# Altium schematic sheet Power.SchDoc
size A; DocumentNumber: 1; SheetNumber: 1; SheetTotal: 3
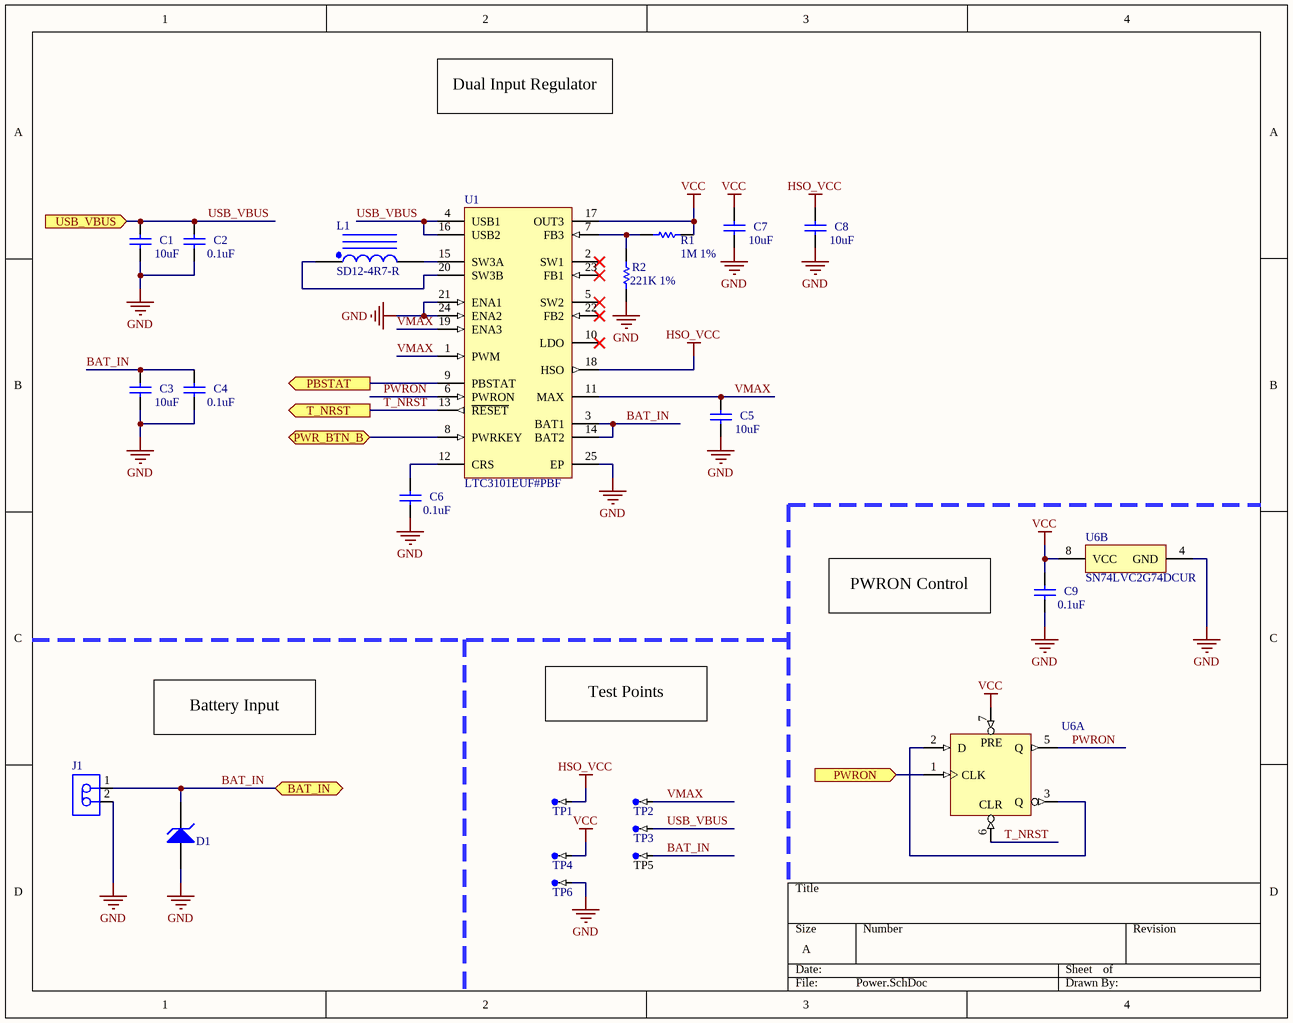
[diagram p0: Power.SchDoc]

## Parts
(Parts that share a designator on the sheet are numbered #1, #2 ... from top to bottom, then left to right.)
C1  10uF  [CAPC0603(1608)100_L]
C2  0.1uF  [CAPC0603(1608)100_L]
C3  10uF  [CAPC0603(1608)100_L]
C4  0.1uF  [CAPC0603(1608)100_L]
C5  10uF  [CAPC0603(1608)100_L]
C6  0.1uF  [CAPC0603(1608)100_L]
C7  10uF  [CAPC0603(1608)100_L]
C8  10uF  [CAPC0603(1608)100_L]
C9  0.1uF  [CAPC0603(1608)100_L]
D1  XGD10603MR  [TECO-0603_V]  (value not drawn)
J1  640456-2  [TECO-640456-2_V]  (value not drawn)
L1  SD12-4R7-R  [EATN-SD12_V]
R1  1M 1%  [RESC0603(1608)_N]
R2  221K 1%  [RESC0603(1608)_N]
TP1  TP-SM-C-100  [TP-SM-C-100]  (value not drawn)  (no BOM)
TP2  TP-SM-C-100  [TP-SM-C-100]  (value not drawn)  (no BOM)
TP3  TP-SM-C-100  [TP-SM-C-100]  (value not drawn)  (no BOM)
TP4  TP-SM-C-100  [TP-SM-C-100]  (value not drawn)  (no BOM)
TP5  TP-SM-C-100  [TP-SM-C-100]  (value not drawn)  (no BOM)
TP6  TP-SM-C-100  [TP-SM-C-100]  (value not drawn)  (no BOM)
U1  LTC3101EUF#PBF  [LT-UF-24_N]
U6#1  SN74LVC2G74DCUR  [DCU0008A_N]  (part B of 2)
U6#2  SN74LVC2G74DCUR  [DCU0008A_N]  (value not drawn)  (part A of 2)

## Ports
BAT_IN (bidir), PBSTAT (out), PWR_BTN_B (bidir), PWRON (in), T_NRST (out), USB_VBUS (in)

## Nets
GND: C1.1 C2.2 C3.1 C4.2 C5.1 C6.2 C7.1 C8.1 C9.2 D1.1(A) J1.2 R2.1 TP6.1 U1.21(ENA1) U1.24(ENA2) U1.25(EP) U6#1.4(GND)
HSO_VCC: C8.2 TP1.1 U1.18(HSO)
VCC: C7.2 C9.1 R1.1 TP4.1 U1.17(OUT3) U6#1.8(VCC) U6#2.7(~{PRE})
BAT_IN: C3.2 C4.1 D1.2(K) J1.1 TP5.1 U1.3(BAT1) U1.14(BAT2) ; port BAT_IN
PBSTAT: U1.9(PBSTAT) ; port PBSTAT
PWR_BTN_B: U1.8(PWRKEY) ; port PWR_BTN_B
PWRON: U1.6(PWRON) U6#2.5(Q)
PWRON: U6#2.1(CLK) ; port PWRON  [a separate net that carries the same name]
T_NRST: U1.13(~{RESET}) U6#2.6(~{CLR}) ; port T_NRST
USB_VBUS: C1.2 C2.1 TP3.1 U1.4(USB1) U1.16(USB2) ; port USB_VBUS
VMAX: C5.2 TP2.1 U1.1(PWM) U1.11(MAX) U1.19(ENA3)
NetC6_1: C6.1 U1.12(CRS)
NetL1_1: L1.1 U1.20(SW3B)
NetL1_2: L1.2 U1.15(SW3A)
NetR1_2: R1.2 R2.2 U1.7(FB3)
NetU6#2_2: U6#2.2(D) U6#2.3(Q)

Not connected (* = marked no-connect by the designer): U1 2(SW1)* 5(SW2)* 10(LDO)* 22(FB2)* 23(FB1)*

## Notes on the sheet
- Dual Input Regulator
- PWRON Control
- Battery Input
- Test Points
- (in symbol CMP-0859-00648-3, part A) PRE; CLR

## Library data of the parts
C1-C9 = CMP-1035-00873-1: CAP 27pF 16V ±0.5pF 0603 (1608 Metric) Thickness 1mm SMD; Tolerance: Â±0.5pF; Case-Metric: 1608; Case-EIA: 0603; Value: 27pF; Max Thickness: 1 mm; Rated Voltage: 16 V; Technology: SMT
D1 = CMP-2000-06889-1: ESD Protector Overvoltage Protection Device, 0.25 pF, 24 V, -55 to 125 degC, 2-Pin SMD (0603), RoHS, Tape and Reel; Manufacturer: TE Connectivity; Capacitance Value: 0.25pF; Rad Hardened: No; Leakage Current (Max): 10uA; Clamping Voltage: 45(Typ)V; Product Height (mm): 0.55mm; Working Voltage: 24V; Product Length (mm): 1.7(Max)mm; Direction Type: Bi-Directional; Number of  Elements: 1; Product Depth (mm): 1(Max)mm; Datasheet Version: Rev. G, 11/2012; Package Reference: 0603; Operating Temperature Max Deg. C: 125C; Packaging: TapeandReel/Box; Leakage Current: 10uA; Datasheet URL: https://datasheet.ciiva.com/30563/eng-ss-scd27256-c-30563476.pdf; Mounting: SurfaceMount; Manufacturer URL: http://www.te.com/; Operating Temperature Classification: Military; Reverse Stand-off Voltage: 24V; Working Voltage (Max): 24V; Mounting Style: SurfaceMount; Operating Temperature Min Deg. C: -55C; Operating Temp Range: -55Cto125C; Pin Count: 2; Mounting Technology: SurfaceMount; Package Description: 2-Pin Surface Mount Device, Body 1.60 x 0.825 mm
J1 = CMP-2000-05417-1: Male Header, Pitch 2.54 mm, 1 x 2 Position, Height 10.49 mm, Tail Length 3.556 mm, -55 to 105 degC, RoHS, Bulk; Manufacturer: TE Connectivity; Standards: RoHSCompliant,ELVCompliant,UL94V-0; Material, Housing: Polyester; Agency Approvals: CSA,UL; Brand/Series: MTA-100Series; Contact Centerline Spacing: 0.100 / in.; Material, Contact: CopperAlloy; Current, Rating: 5 / A; Color, Housing: White; Contact Termination Area Plating: Tin; Special Features: Pinstrip; Number of Positions: 2; Pin Spacing: 0.1 / "; Temperature, Operating: -55to+105 / degC; Angle: Straight; Mount Angle: Vertical; Connector Type: MTA-100; Primary Type: InterconnectSystem; Voltage, Rating: 250 / V; Mounting Hole Size: 0.04 / "; Number of Rows: 1; Termination: Solder; Length, Terminal Post: 0.14 / in.; Manufacturer URL: http://www.te.com/; Color: White; Size, Post: 0.025 / in.; Contact Shape: Square; Mounting Type: PCMount; Datasheet URL: https://datasheet.ciiva.com/11746/0900766b80eb7fdd-11746365.pdf; Type: PCBPlug; Datasheet Version: Rev. W, 06/2004; Number of Contacts: 2; Flammability Rating: UL94V-0; Contact Plating: Tin; Length, Pin: 0.14 / "; Contact Mating Area Plating: Tin; Length, Overall: 0.2 / "
L1 = CMP-2000-07038-1: SD Series High Power Density, Low Profile, Shielded Inductor, 4.7 uH, -40 to 85 degC, 2-Pin SMD, RoHS, Tape and Reel; Manufacturer: Eaton; Maximum DC Resistance: 117.7mOhms; Unit Weight: 0.032000oz; Test Frequency: 100kHz; Inductance: 4.7uH; Maximum DC Current: 1.29A; Brand: Coiltronics/Eaton; Tolerance: 20%; Core Material: Ferrite; Type: LowProfilePowerInductor; Height: 1.2mm; Width: 5.2mm; Product Category: FixedInductors; Shielding: Shielded; Operating Temperature Range: -40Cto+85C; Series: SD; Datasheet Version: 03/2007; Datasheet URL: http://datasheet.octopart.com/SD12-4R7-R-Coiltronics-datasheet-5402826.pdf; Package Description: 2-Pin Surface Mount Device, Body 5.2 x 5.2 mm; RoHS: True; Mounting Technology: SurfaceMount; Packaging: Reel; Package Reference: SD12; Length: 5.2mm; Product: PowerInductors; Factory Pack Quantity: 3800; Termination Style: SMD/SMT; Manufacturer URL: http://www.eaton.com/
R1 R2 = CMP-1012-00001-1: Jumper 0603 (1608 Metric); Case-Metric: 1608; Value: 0.00 Ohm; Power: None; Case-EIA: 0603; Technology: SMT; Tolerance: None
TP1-TP6 = CMP-0484-00002-2: Test Point, Surface Mount, Circular, Pad Diameter 1 mm; Manufacturer: No Vendor; PartNumber: TP-SM-C-100
U1 = CMP-0478-00246-1: Wide Vin, Multi-Output DC/DC Converter and PowerPath Controller, 1.8 to 5.5 V Vin, 24-pin QFN (UF-24), -40 to 85 degC, Pb-Free; Manufacturer: Linear Technology; Number of Outputs: 3; Vin Max(V): 5.5; Vin Min(V): 1.8; PackageDescription: 24-Pin Plastic QFN, Body 4 x 4 mm, Pitch 0.5 mm; DatasheetVersion: Rev. B; ComponentLink2URL: http://cds.linear.com/docs/en/datasheet/3101fb.pdf; Code_JEDEC: MO-220; RoHS: TRUE; Mounting Technology: Surface Mount; PartNumber: LTC3101EUF#PBF; PackageReference: UF24; ComponentLink1URL: http://www.linear.com/; ComponentLink3Description: Package Specification; ComponentLink2Description: Datasheet; PackageVersion: Rev. B, 02/2012; ComponentLink3URL: http://cds.linear.com/docs/en/packaging/%28UF24%29%20QFN%2005-08-1697%20Rev%20B.pdf; ComponentLink1Description: Manufacturer URL
U6#1 U6#2 = CMP-0859-00648-3: Single Positive-Edge-Triggered D-Type Flip-Flop with Clear and Preset, DCU0008A, LARGE T&R; Manufacturer: Texas Instruments; F @ Nom Voltage(Max)(Mhz): 150; Bits(#): 1; Voltage(Nom)(V): 1.8,2.5,3.3,5; tpd @ Nom Voltage(Max)(ns): 13.4,7.1,5.9,4.1; Technology Family: LVC; Output Drive (IOL/IOH)(Max)(mA): 32/-32; ICC @ Nom Voltage(Max)(mA): 0.01; 3-State Output: No; Output Type: CMOS; VCC(Max)(V): 5.5; Logic: True; Input Type: CMOS/TTL; Rating: Catalog; VCC(Min)(V): 1.65; Sub-Family: D-Type Flip-Flop; Operating Temperature Range(C): -40 to 125,-40 to 85; Generic Part Number: SN74LVC2G74; Schmitt Trigger: No; PackageReference: DCU0008A; DatasheetVersion: SCES203O